# Altium schematic sheet Eload Gen 3 Power Module -Display.SchDoc
size A
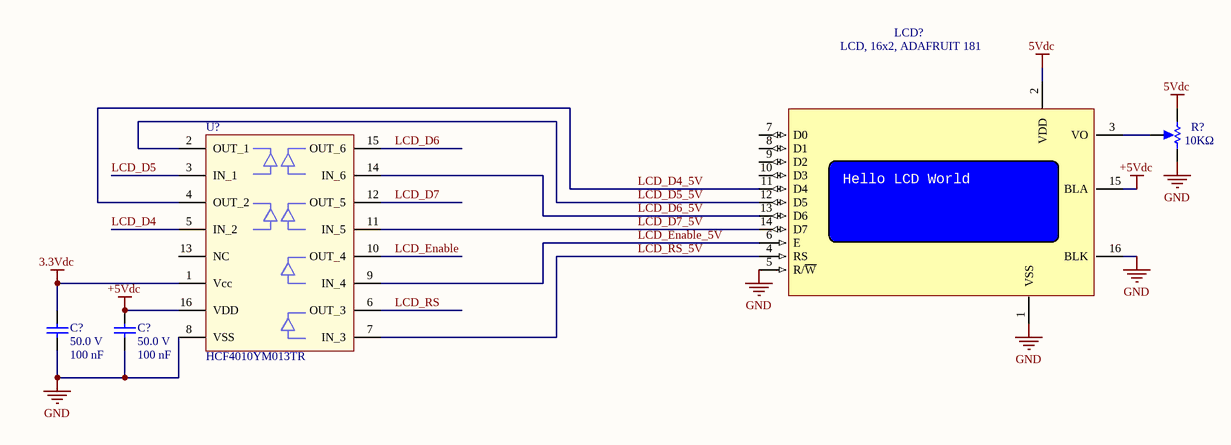
[diagram p0: Eload Gen 3 Power Module -Display.SchDoc]

## Parts
(Parts that share a designator on the sheet are numbered #1, #2 ... from top to bottom, then left to right.)
C?#1  Voltage Rating (DC): 50.0 V  Capacitance: 100 nF  [Cap,0805]  (hidden comment: 08055C104JAT2A)
C?#2  Voltage Rating (DC): 50.0 V  Capacitance: 100 nF  [Cap,0805]  (hidden comment: 08055C104JAT2A)
LCD?  LCD, 16x2, ADAFRUIT 181  [LCD Module 16x2]
R?  Resistance: 10KΩ  (hidden comment: TC33X-2-103E)
U?  HCF4010YM013TR  [SOIC-16]

## Nets
3.3Vdc: C?#1.2 U?.1(Vcc)
5Vdc: LCD?.2(VDD) R?.3
+5Vdc: C?#2.2 LCD?.15(BLA) U?.16(VDD)
GND: C?#1.1 C?#2.1 LCD?.1(VSS) LCD?.5(R/~{W}) LCD?.16(BLK) R?.1 U?.8(VSS)
LCD_D4: U?.5(IN_2)
LCD_D4_5V: LCD?.11(D4) U?.4(OUT_2)
LCD_D5: U?.3(IN_1)
LCD_D5_5V: LCD?.12(D5) U?.2(OUT_1)
LCD_D6: U?.15(OUT_6)
LCD_D6_5V: LCD?.13(D6) U?.14(IN_6)
LCD_D7: U?.12(OUT_5)
LCD_D7_5V: LCD?.14(D7) U?.11(IN_5)
LCD_Enable: U?.10(OUT_4)
LCD_Enable_5V: LCD?.6(E) U?.9(IN_4)
LCD_RS: U?.6(OUT_3)
LCD_RS_5V: LCD?.4(RS) U?.7(IN_3)
NetLCD?_3: LCD?.3(VO) R?.2

Not connected (* = marked no-connect by the designer): LCD? 7(D0) 8(D1) 9(D2) 10(D3); U? 13(NC)

## Notes on the sheet
- (in symbol LCD, 16x2, ADAFRUIT 181) Hello LCD World

## Library data of the parts
C?#1 C?#2 = Cap,0805,100nf,50V,5%,08055C104JAT2A: Capacitor; Ceramic; Cap 0.1 uF; Tol 5%; Vol-Rtg 50 VDC; SMT; 0805; X7R; Tape & Reel; Lead-Free Status: Lead Free; Case/Package (SI): 2012; Insulation Resistance: 100 GΩ; Detailed Description: 0.1µF ±5% 50V Ceramic Capacitor X7R 0805 (2012 Metric); Mounting Style: Surface Mount; Packaging: Tape & Reel (TR), Cut Tape (CT); RoHS: Compliant; Size-Width: 1.24 mm; Case/Package: 0805; Number of Pins: 2; digikey url: http://www.digikey.ca/product-detail/en/avx-corporation/08055C104JAT2A/478-3352-1-ND/930144; REACH SVHC Compliance: No SVHC; Dielectric Characteristic: X7R; Capacitance Tolerance: ±5%; Size-Length: 2.01 mm; Size-Height: 710 µm; Size-Thickness: 940 µm; Manufacturer Part Number: 08055C104JAT2A; Octopart URL: http://octopart.com/08055c104jat2a-avx-55388010; Operating Temperature: -55°C ~ 125°C; Supplier 1: Digi-Key; Supplier Part Number 1: 478-3352-1-ND
LCD? = LCD, 16x2, ADAFRUIT 181: LCD Character Display; 4x20 Char.; 98x60; STN- BLUE; Transmissive; 8-Bit Parallel; Display Type: STN - Super-Twisted Nematic; Backlight: LED - White; Voltage - Supply: 4.8 V ~ 5.2 V; Interface: Parallel, 8-Bit; Text Color: White; mfg P/N: ADAFRUIT 181; Display Format: 16 x 2; Display Mode: Transmissive; Operating Temperature: -20°C ~ 70°C; Background Color: Blue
R? = Res,POT,SMD,10KΩ,0.1W, TC33X-2-103E: TRIMMER 10K OHM 0.1W J LEAD TOP; Manufacturer: Bourns Inc.; Detailed Description: 10 kOhms 0.1W, 1/10W J Lead Surface Mount Trimmer Potentiometer Cermet 1 Turn Top Adjustment; Power (Watts): 0.1W, 1/10W; Tolerance: ±25%; Temperature Coefficient: ±250ppm/°C; Adjustment Type: Top Adjustment; Resistive Material: Cermet; Number of Turns: 1; mfg P/N: TC33X-2-103E; Datasheets: TC33 Series; Category: Potentiometers, Variable Resistors  Trimmer Potentiometers; Series: Trimpot® TC33 - Open Frame; Part Status: Active; Mounting Type: Surface Mount; Termination Style: J Lead; Size / Dimension: Rectangular - 0.150"" x 0.142"" Face x 0.047"" H (3.80mm x 3.60mm x 1.20mm); Supplier 1: Digi-Key; Supplier Part Number 1: TC33X-103ECT-ND
U? = IC,Level Shiffter,Uni-Dir,6 Circuit,SOIC16,HCF4010YM013TR: IC TRNSLTR UNIDIRECTIONAL 16SO; Manufacturer: STMicroelectronics; TYPE DESCRIPTION SELECT  Category   Integrated Circuits (ICs)  Logic - Translators, Level Shifters  Manufacturer   STMicroelectronics  Series   Automotive, AEC-Q100, 4000  Packaging   Tape & Reel (TR)  Cut Tape (CT)  Digi-Reel®  Part Status   Active  Translator Type: Voltage Level; Detailed Description: Voltage Level Translator Unidirectional 6 Circuit 1 Channel 16-SO; Channels per Circuit: 1; Output Type: Non-Inverted; Number of Circuits: 6; Voltage - VCCA: 3V ~ 20V; mfg P/N: HCF4010YM013TR; Category: Integrated Circuits (ICs)  Logic - Translators, Level Shifters; Series: Automotive, AEC-Q100, 4000; Packaging: Tape & Reel (TR)  Cut Tape (CT)  Digi-Reel®; Part Status: Active; Channel Type: Unidirectional; Operating Temperature: -40°C ~ 125°C (TA); Mounting Type: Surface Mount; Package / Case: 16-SOIC (0.154"", 3.90mm Width); Supplier Device Package: 16-SO; Voltage - VCCB: 3V ~ 20V; Supplier 1: Digi-Key; Supplier Part Number 1: 497-13665-6-ND